# Altium schematic sheet 1Teclado.SchDoc
size A4
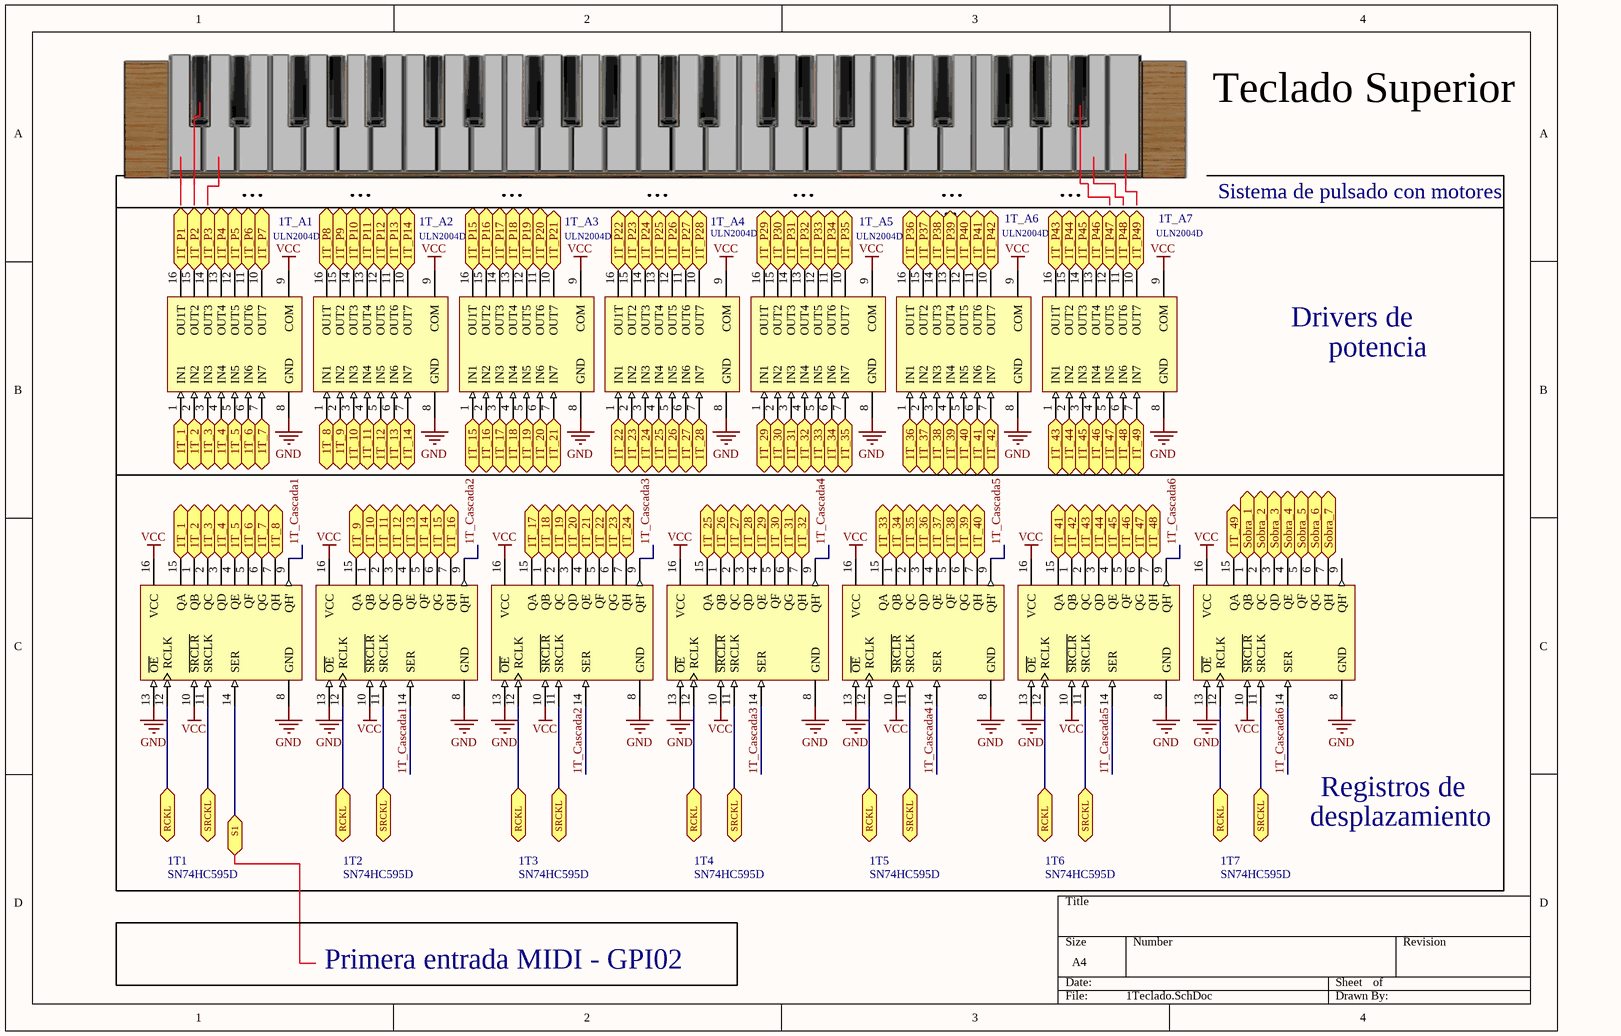
[diagram p0: 1Teclado.SchDoc]

## Parts
1T1  SN74HC595D  [D016_N]
1T2  SN74HC595D  [D016_N]
1T3  SN74HC595D  [D016_N]
1T4  SN74HC595D  [D016_N]
1T5  SN74HC595D  [D016_N]
1T6  SN74HC595D  [D016_N]
1T7  SN74HC595D  [D016_N]
1T_A1  ULN2004D  [SO16_N]
1T_A2  ULN2004D  [SO16_N]
1T_A3  ULN2004D  [SO16_N]
1T_A4  ULN2004D  [SO16_N]
1T_A5  ULN2004D  [SO16_N]
1T_A6  ULN2004D  [SO16_N]
1T_A7  ULN2004D  [SO16_N]

## Ports
1T_1, 1T_2, 1T_3, 1T_4, 1T_5, 1T_6, 1T_7, 1T_8, 1T_9, 1T_10, 1T_11, 1T_12, 1T_13, 1T_14, 1T_15, 1T_16, 1T_17, 1T_18, 1T_19, 1T_20, 1T_21, 1T_22, 1T_23, 1T_24, 1T_25, 1T_26, 1T_27, 1T_28, 1T_29, 1T_30, 1T_31, 1T_32, 1T_33, 1T_34, 1T_35, 1T_36, 1T_37, 1T_38, 1T_39, 1T_40, 1T_41, 1T_42, 1T_43, 1T_44, 1T_45, 1T_46, 1T_47, 1T_48, 1T_49, 1T_P1, 1T_P2, 1T_P3, 1T_P4, 1T_P5, 1T_P6, 1T_P7, 1T_P8, 1T_P9, 1T_P10, 1T_P11, 1T_P12, 1T_P13, 1T_P14, 1T_P15, 1T_P16, 1T_P17, 1T_P18, 1T_P19, 1T_P20, 1T_P21, 1T_P22, 1T_P23, 1T_P24, 1T_P25, 1T_P26, 1T_P27, 1T_P28, 1T_P29, 1T_P30, 1T_P31, 1T_P32, 1T_P33, 1T_P34, 1T_P35, 1T_P36, 1T_P37, 1T_P38, 1T_P39, 1T_P40, 1T_P41, 1T_P42, 1T_P43, 1T_P44, 1T_P45, 1T_P46, 1T_P47, 1T_P48, 1T_P49, RCKL, S1, Sobra_1, Sobra_2, Sobra_3, Sobra_4, Sobra_5, Sobra_6, Sobra_7, SRCKL

## Nets
GND: 1T1.8(GND) 1T1.13(~{OE}) 1T2.8(GND) 1T2.13(~{OE}) 1T3.8(GND) 1T3.13(~{OE}) 1T4.8(GND) 1T4.13(~{OE}) 1T5.8(GND) 1T5.13(~{OE}) 1T6.8(GND) 1T6.13(~{OE}) 1T7.8(GND) 1T7.13(~{OE}) 1T_A1.8(GND) 1T_A2.8(GND) 1T_A3.8(GND) 1T_A4.8(GND) 1T_A5.8(GND) 1T_A6.8(GND) 1T_A7.8(GND)
VCC: 1T1.10(~{SRCLR}) 1T1.16(VCC) 1T2.10(~{SRCLR}) 1T2.16(VCC) 1T3.10(~{SRCLR}) 1T3.16(VCC) 1T4.10(~{SRCLR}) 1T4.16(VCC) 1T5.10(~{SRCLR}) 1T5.16(VCC) 1T6.10(~{SRCLR}) 1T6.16(VCC) 1T7.10(~{SRCLR}) 1T7.16(VCC) 1T_A1.9(COM) 1T_A2.9(COM) 1T_A3.9(COM) 1T_A4.9(COM) 1T_A5.9(COM) 1T_A6.9(COM) 1T_A7.9(COM)
1T_1: 1T1.15(QA) 1T_A1.1(IN1) ; port 1T_1
1T_2: 1T1.1(QB) 1T_A1.2(IN2) ; port 1T_2
1T_3: 1T1.2(QC) 1T_A1.3(IN3) ; port 1T_3
1T_4: 1T1.3(QD) 1T_A1.4(IN4) ; port 1T_4
1T_5: 1T1.4(QE) 1T_A1.5(IN5) ; port 1T_5
1T_6: 1T1.5(QF) 1T_A1.6(IN6) ; port 1T_6
1T_7: 1T1.6(QG) 1T_A1.7(IN7) ; port 1T_7
1T_8: 1T1.7(QH) 1T_A2.1(IN1) ; port 1T_8
1T_9: 1T2.15(QA) 1T_A2.2(IN2) ; port 1T_9
1T_10: 1T2.1(QB) 1T_A2.3(IN3) ; port 1T_10
1T_11: 1T2.2(QC) 1T_A2.4(IN4) ; port 1T_11
1T_12: 1T2.3(QD) 1T_A2.5(IN5) ; port 1T_12
1T_13: 1T2.4(QE) 1T_A2.6(IN6) ; port 1T_13
1T_14: 1T2.5(QF) 1T_A2.7(IN7) ; port 1T_14
1T_15: 1T2.6(QG) 1T_A3.1(IN1) ; port 1T_15
1T_16: 1T2.7(QH) 1T_A3.2(IN2) ; port 1T_16
1T_17: 1T3.15(QA) 1T_A3.3(IN3) ; port 1T_17
1T_18: 1T3.1(QB) 1T_A3.4(IN4) ; port 1T_18
1T_19: 1T3.2(QC) 1T_A3.5(IN5) ; port 1T_19
1T_20: 1T3.3(QD) 1T_A3.6(IN6) ; port 1T_20
1T_21: 1T3.4(QE) 1T_A3.7(IN7) ; port 1T_21
1T_22: 1T3.5(QF) 1T_A4.1(IN1) ; port 1T_22
1T_23: 1T3.6(QG) 1T_A4.2(IN2) ; port 1T_23
1T_24: 1T3.7(QH) 1T_A4.3(IN3) ; port 1T_24
1T_25: 1T4.15(QA) 1T_A4.4(IN4) ; port 1T_25
1T_26: 1T4.1(QB) 1T_A4.5(IN5) ; port 1T_26
1T_27: 1T4.2(QC) 1T_A4.6(IN6) ; port 1T_27
1T_28: 1T4.3(QD) 1T_A4.7(IN7) ; port 1T_28
1T_29: 1T4.4(QE) 1T_A5.1(IN1) ; port 1T_29
1T_30: 1T4.5(QF) 1T_A5.2(IN2) ; port 1T_30
1T_31: 1T4.6(QG) 1T_A5.3(IN3) ; port 1T_31
1T_32: 1T4.7(QH) 1T_A5.4(IN4) ; port 1T_32
1T_33: 1T5.15(QA) 1T_A5.5(IN5) ; port 1T_33
1T_34: 1T5.1(QB) 1T_A5.6(IN6) ; port 1T_34
1T_35: 1T5.2(QC) 1T_A5.7(IN7) ; port 1T_35
1T_36: 1T5.3(QD) 1T_A6.1(IN1) ; port 1T_36
1T_37: 1T5.4(QE) 1T_A6.2(IN2) ; port 1T_37
1T_38: 1T5.5(QF) 1T_A6.3(IN3) ; port 1T_38
1T_39: 1T5.6(QG) 1T_A6.4(IN4) ; port 1T_39
1T_40: 1T5.7(QH) 1T_A6.5(IN5) ; port 1T_40
1T_41: 1T6.15(QA) 1T_A6.6(IN6) ; port 1T_41
1T_42: 1T6.1(QB) 1T_A6.7(IN7) ; port 1T_42
1T_43: 1T6.2(QC) 1T_A7.1(IN1) ; port 1T_43
1T_44: 1T6.3(QD) 1T_A7.2(IN2) ; port 1T_44
1T_45: 1T6.4(QE) 1T_A7.3(IN3) ; port 1T_45
1T_46: 1T6.5(QF) 1T_A7.4(IN4) ; port 1T_46
1T_47: 1T6.6(QG) 1T_A7.5(IN5) ; port 1T_47
1T_48: 1T6.7(QH) 1T_A7.6(IN6) ; port 1T_48
1T_49: 1T7.15(QA) 1T_A7.7(IN7) ; port 1T_49
1T_Cascada1: 1T1.9(QH') 1T2.14(SER)
1T_Cascada2: 1T2.9(QH') 1T3.14(SER)
1T_Cascada3: 1T3.9(QH') 1T4.14(SER)
1T_Cascada4: 1T4.9(QH') 1T5.14(SER)
1T_Cascada5: 1T5.9(QH') 1T6.14(SER)
1T_Cascada6: 1T6.9(QH') 1T7.14(SER)
1T_P1: 1T_A1.16(OU1T) ; port 1T_P1
1T_P2: 1T_A1.15(OUT2) ; port 1T_P2
1T_P3: 1T_A1.14(OUT3) ; port 1T_P3
1T_P4: 1T_A1.13(OUT4) ; port 1T_P4
1T_P5: 1T_A1.12(OUT5) ; port 1T_P5
1T_P6: 1T_A1.11(OUT6) ; port 1T_P6
1T_P7: 1T_A1.10(OUT7) ; port 1T_P7
1T_P8: 1T_A2.16(OU1T) ; port 1T_P8
1T_P9: 1T_A2.15(OUT2) ; port 1T_P9
1T_P10: 1T_A2.14(OUT3) ; port 1T_P10
1T_P11: 1T_A2.13(OUT4) ; port 1T_P11
1T_P12: 1T_A2.12(OUT5) ; port 1T_P12
1T_P13: 1T_A2.11(OUT6) ; port 1T_P13
1T_P14: 1T_A2.10(OUT7) ; port 1T_P14
1T_P15: 1T_A3.16(OU1T) ; port 1T_P15
1T_P16: 1T_A3.15(OUT2) ; port 1T_P16
1T_P17: 1T_A3.14(OUT3) ; port 1T_P17
1T_P18: 1T_A3.13(OUT4) ; port 1T_P18
1T_P19: 1T_A3.12(OUT5) ; port 1T_P19
1T_P20: 1T_A3.11(OUT6) ; port 1T_P20
1T_P21: 1T_A3.10(OUT7) ; port 1T_P21
1T_P22: 1T_A4.16(OU1T) ; port 1T_P22
1T_P23: 1T_A4.15(OUT2) ; port 1T_P23
1T_P24: 1T_A4.14(OUT3) ; port 1T_P24
1T_P25: 1T_A4.13(OUT4) ; port 1T_P25
1T_P26: 1T_A4.12(OUT5) ; port 1T_P26
1T_P27: 1T_A4.11(OUT6) ; port 1T_P27
1T_P28: 1T_A4.10(OUT7) ; port 1T_P28
1T_P29: 1T_A5.16(OU1T) ; port 1T_P29
1T_P30: 1T_A5.15(OUT2) ; port 1T_P30
1T_P31: 1T_A5.14(OUT3) ; port 1T_P31
1T_P32: 1T_A5.13(OUT4) ; port 1T_P32
1T_P33: 1T_A5.12(OUT5) ; port 1T_P33
1T_P34: 1T_A5.11(OUT6) ; port 1T_P34
1T_P35: 1T_A5.10(OUT7) ; port 1T_P35
1T_P36: 1T_A6.16(OU1T) ; port 1T_P36
1T_P37: 1T_A6.15(OUT2) ; port 1T_P37
1T_P38: 1T_A6.14(OUT3) ; port 1T_P38
1T_P39: 1T_A6.13(OUT4) ; port 1T_P39
1T_P40: 1T_A6.12(OUT5) ; port 1T_P40
1T_P41: 1T_A6.11(OUT6) ; port 1T_P41
1T_P42: 1T_A6.10(OUT7) ; port 1T_P42
1T_P43: 1T_A7.16(OU1T) ; port 1T_P43
1T_P44: 1T_A7.15(OUT2) ; port 1T_P44
1T_P45: 1T_A7.14(OUT3) ; port 1T_P45
1T_P46: 1T_A7.13(OUT4) ; port 1T_P46
1T_P47: 1T_A7.12(OUT5) ; port 1T_P47
1T_P48: 1T_A7.11(OUT6) ; port 1T_P48
1T_P49: 1T_A7.10(OUT7) ; port 1T_P49
RCKL: 1T1.12(RCLK) 1T2.12(RCLK) 1T3.12(RCLK) 1T4.12(RCLK) 1T5.12(RCLK) 1T6.12(RCLK) 1T7.12(RCLK) ; port RCKL
S1: 1T1.14(SER) ; port S1
Sobra_1: 1T7.1(QB) ; port Sobra_1
Sobra_2: 1T7.2(QC) ; port Sobra_2
Sobra_3: 1T7.3(QD) ; port Sobra_3
Sobra_4: 1T7.4(QE) ; port Sobra_4
Sobra_5: 1T7.5(QF) ; port Sobra_5
Sobra_6: 1T7.6(QG) ; port Sobra_6
Sobra_7: 1T7.7(QH) ; port Sobra_7
SRCKL: 1T1.11(SRCLK) 1T2.11(SRCLK) 1T3.11(SRCLK) 1T4.11(SRCLK) 1T5.11(SRCLK) 1T6.11(SRCLK) 1T7.11(SRCLK) ; port SRCKL

Not connected (* = marked no-connect by the designer): 1T7 9(QH')

## Notes on the sheet
- Teclado Superior
- ...
- Sistema de pulsado con motores
- Drivers de
- potencia
- desplazamiento
- Registros de
- Primera entrada MIDI - GPI02

## Library data of the parts
1T1-1T7 = SN74HC595D: 8-Bit Shift Register with 3-State Output Registers; Published: 8-Jun-2000; LatestRevisionDate: 13-Apr-2006; LatestRevisionNote: IPC-7351 Footprint Added.; DatasheetVersion: May-1997; PackageVersion: Jan-1998; PackageReference: D016; Publisher: Altium Limited; PackageDescription: 16-Pin Small Outline Integrated Circuit 1.27 mm Pitch; Code_IPC: SOIC127P600-16; ComponentLink1Description: Manufacturer Link; ComponentLink1URL: http://www.ti.com/; ComponentLink2Description: Datasheet; ComponentLink2URL: http://www-s.ti.com/sc/ds/sn74hc595.pdf
1T_A1-1T_A7 = ULN2004D: Seven Darlington Array; Published: 8-Jun-2000; LatestRevisionDate: 13-Apr-2006; LatestRevisionNote: IPC-7351 Footprint Added.; DatasheetVersion: Sep-1998; PackageVersion: May-1998; PackageReference: SO16; Publisher: Altium Limited; PackageDescription: 16-Pin Small Outline Integrated Circuit 1.27 mm Pitch; Code_IPC: SOIC127P600-16; ComponentLink1Description: Manufacturer Link; ComponentLink1URL: http://www.st.com/; ComponentLink2Description: Datasheet; ComponentLink2URL: http://www.st.com/stonline/products/literature/ds/5279/uln2001.pdf